# Altium schematic sheet USB_OTG_FS.SchDoc: USB_OTG_FS
size A3; Date: 04/02/2015; Author: P.A.; CompanyName: STMicroelectronics; Organization: Microcontrollers Division; Address1: 12, Rue Jules HOROWITZ; Address2: 38019 Grenoble; Address3: FRANCE; DocumentNumber: MB1209; Revision: D-02; SheetNumber: 8; SheetTotal: 11; Project: STM32F412G-DISCO; ModifiedDate: 6/2/2016
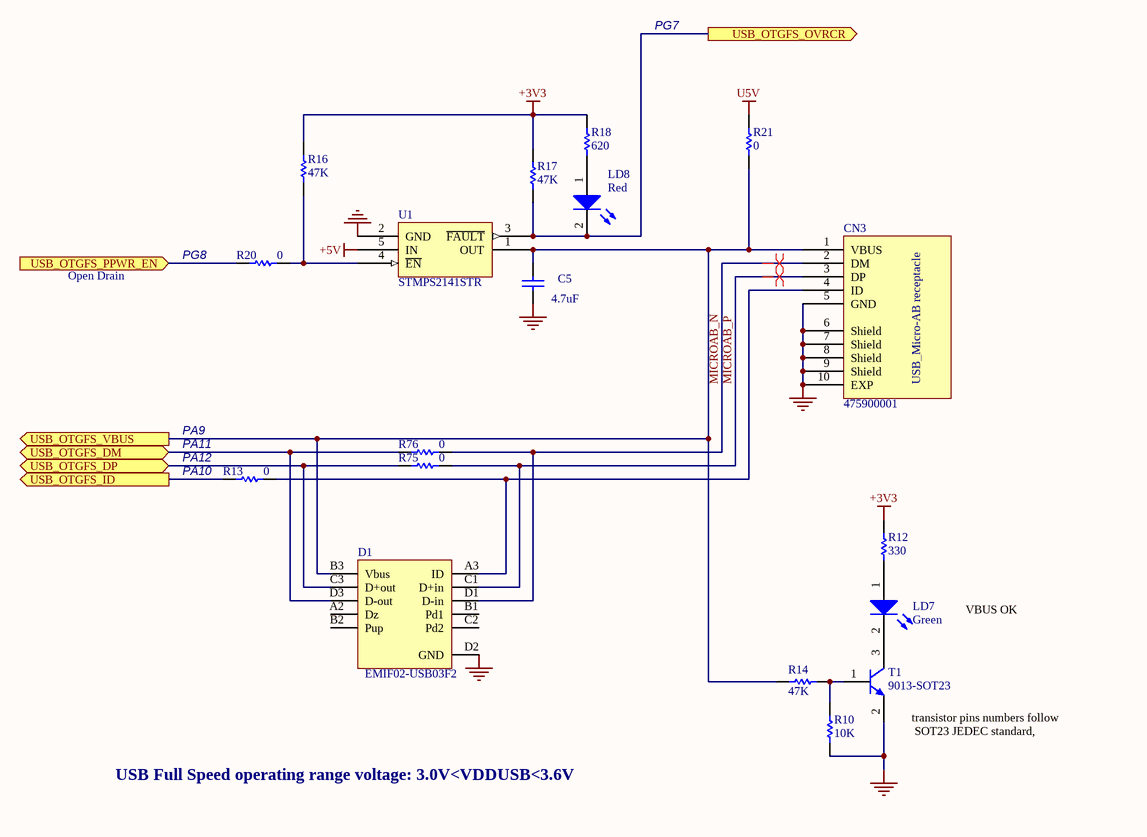
[diagram p0: USB_OTG_FS.SchDoc]

## Parts
C5  4.7uF  [0603C]
CN3  475900001  [MOLEX_47590001]
D1  EMIF02-USB03F2  [BGA11_0R5_1R57X2R07]
LD7  Green  [0603D]
LD8  Red  [0603D]
R10  10K  [0402R]
R12  330  [0402R]
R13  0  [SB_0603]
R14  47K  [0402R]
R16  47K  [0402R]
R17  47K  [0402R]
R18  620  [0402R]
R20  0  [SB_0603]
R21  0  [SB_0603]
R75  0  [SB_0603]
R76  0  [SB_0603]
T1  9013-SOT23  [SOT-23]
U1  STMPS2141STR  [SOT23-5]

## Ports
USB_OTGFS_DM (bidir), USB_OTGFS_DP (bidir), USB_OTGFS_ID (out), USB_OTGFS_OVRCR (out), USB_OTGFS_PPWR_EN (in), USB_OTGFS_VBUS (out)

## Nets
+3V3: R12.1 R16.1 R17.1 R18.1
+5V: U1.5(IN)
GND: C5.2 CN3.5(GND) CN3.6(Shield) CN3.7(Shield) CN3.8(Shield) CN3.9(Shield) CN3.10(EXP) D1.D2(GND) R10.2 T1.2(E) U1.2(GND)
U5V: R21.1
MICROAB_N: CN3.2(DM) D1.D1(D-in) R76.1
MICROAB_P: CN3.3(DP) D1.C1(D+in) R75.1
USB_OTGFS_DM: D1.D3(D-out) R76.2 ; port USB_OTGFS_DM
USB_OTGFS_DP: D1.C3(D+out) R75.2 ; port USB_OTGFS_DP
USB_OTGFS_ID: R13.2 ; port USB_OTGFS_ID
USB_OTGFS_OVRCR: LD8.2(K) R17.2 U1.3(~{FAULT}) ; port USB_OTGFS_OVRCR
USB_OTGFS_PPWR_EN: R20.2 ; port USB_OTGFS_PPWR_EN
USB_OTGFS_VBUS: C5.1 CN3.1(VBUS) D1.B3(Vbus) R14.1 R21.2 U1.1(OUT) ; port USB_OTGFS_VBUS
NetCN3_4: CN3.4(ID) D1.A3(ID) R13.1
NetLD7_1: LD7.1(A) R12.2
NetLD7_2: LD7.2(K) T1.3(C)
NetLD8_1: LD8.1(A) R18.2
NetR10_1: R10.1 R14.2 T1.1(B)
NetR16_2: R16.2 R20.1 U1.4(~{EN})

Not connected (* = marked no-connect by the designer): D1 A2(Dz) B1(Pd1) B2(Pup) C2(Pd2)

## Layout directives
differential pair: MICROAB_N, MICROAB_P

## Notes on the sheet
- PG7
- (near R20) PG8
- Open Drain
- PA9
- (near R13) PA11
- (near R13) PA12
- (near R13) PA10
- VBUS OK
- (near T1) transistor pins numbers follow
  SOT23 JEDEC standard,
- USB Full Speed operating range voltage: 3.0V<VDDUSB<3.6V
- Title:
- Project:
- Size:
- Date:
- A3
- Reference:
- Sheet:
- Revision:
- of
- (in symbol 475900001) USB_Micro-AB receptacle

## Library data of the parts
C5 = CAP: Capacitor; Value: 100nF; Ordered by: Subcon; ECCN_US/EU: NA; Published: 8-Jun-2000; Revision: July-2002: Re-released for DXP Platform.; Publisher: Altium Limited
CN3 = 475900001: Ordered by: Subcon; Silkscreen: USB_USER; ECCN_US/EU: NA
D1 = EMIF02-USB03F2: Ordered by: ST; ECCN_US/EU: EAR99/NEC; Ref St: 9179037; Manuf_1: ST; Manuf_Part_1: EMIF02-USB03F2
LD7 = LED2: Typical RED, GREEN, YELLOW, AMBER GaAs LED; Ordered by: Subcon; Silkscreen: VBUS; ECCN_US/EU: EAR99/NEC; Published: 8-Jun-2000; Revision: July-2002: Re-released for DXP Platform.; Publisher: Altium Limited
LD8 = LED2: Typical RED, GREEN, YELLOW, AMBER GaAs LED; Ordered by: Subcon; Silkscreen: FAULT; ECCN_US/EU: EAR99/NEC; Published: 8-Jun-2000; Revision: July-2002: Re-released for DXP Platform.; Publisher: Altium Limited
R10 R12 R14 R16-R18 = res1: Resistor; Value: 1K; Ordered by: Subcon; ECCN_US/EU: NA; Published: 8-Jun-2000; Revision: July-2002: Re-released for DXP Platform.; Publisher: Altium Limited
R13 R20 R21 R75 R76 = Res1: Resistor; Value: 1K; Ordered by: Subcon; ECCN_US/EU: NA; Published: 8-Jun-2000; Revision: July-2002: Re-released for DXP Platform.; Publisher: Altium Limited
T1 = NPN: NPN Bipolar Transistor; Manuf_Part_1: MMBT9013; Code - JEDEC: TO-226-AA; Ordered by: Subcon; ECCN_US/EU: EAR99/NEC; Published: 8-Jun-2000; Revision: July-2002: Re-released for DXP Platform.; Publisher: Altium Limited
U1 = STMPS2141STR: Enhanced single channel power switches; Provided: ST; ECCN_US/EU: EAR99/NEC; Ref St: 9159003; Order: STMPS2141STR; Manuf_Part_1: STMPS2141STR; Manuf_1: ST; Distrib: ST; Ordered by: ST